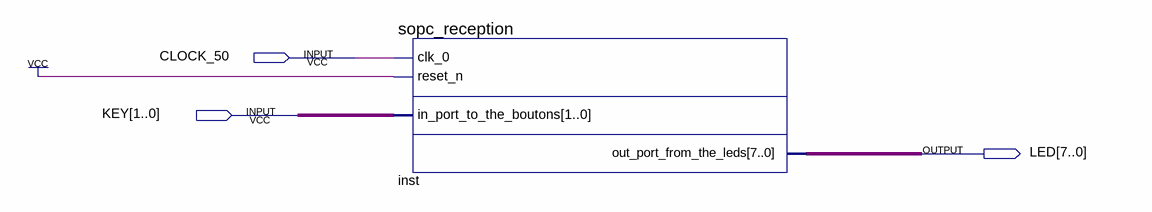
[diagram p0: schematic sheet]
// Quartus schematic NMEA_reception_sopc.bdf as structural Verilog: 1 symbols, 3 pins
module NMEA_reception_sopc (
  input  CLOCK_50,
  input  [1:0] KEY,
  output [7:0] LED
);

  sopc_reception inst (.clk_0(CLOCK_50), .reset_n(1'b1), .in_port_to_the_boutons(KEY), .out_port_from_the_leds(LED));
endmodule
